# Altium schematic sheet PZT Board.SchDoc
size A4; SheetNumber: 4; SheetTotal: 4
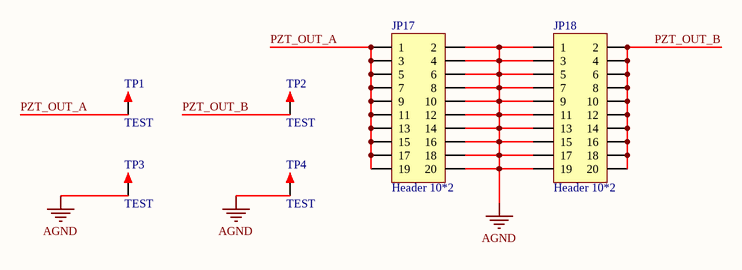
[diagram p0: PZT Board.SchDoc]

## Parts
JP17  Header 10*2  [BTB-0.5MM-SMD-M_2*10PIN]
JP18  Header 10*2  [BTB-0.5MM-SMD-M_2*10PIN]
TP1  TEST  [TEST 2.0]
TP2  TEST  [TEST 2.0]
TP3  TEST  [TEST 2.0]
TP4  TEST  [TEST 2.0]

## Nets
AGND: JP17.2 JP17.4 JP17.6 JP17.8 JP17.10 JP17.12 JP17.14 JP17.16 JP17.18 JP17.20 JP18.1 JP18.3 JP18.5 JP18.7 JP18.9 JP18.11 JP18.13 JP18.15 JP18.17 JP18.19 TP3.1 TP4.1
PZT_OUT_A: JP17.1 JP17.3 JP17.5 JP17.7 JP17.9 JP17.11 JP17.13 JP17.15 JP17.17 JP17.19 TP1.1
PZT_OUT_B: JP18.2 JP18.4 JP18.6 JP18.8 JP18.10 JP18.12 JP18.14 JP18.16 JP18.18 JP18.20 TP2.1

## Library data of the parts
JP17 JP18 = Header 10*2: BTB Connector
TP1-TP4 = TEST: 测试点; 版权归属: 封装库来自淘宝 ID：黄晶宝石; BOM名称: 测试点; 学习资源: https://shop463601444.taobao.com